# EAGLE design sawbench_digital_reva (EAGLE 6.5.0)
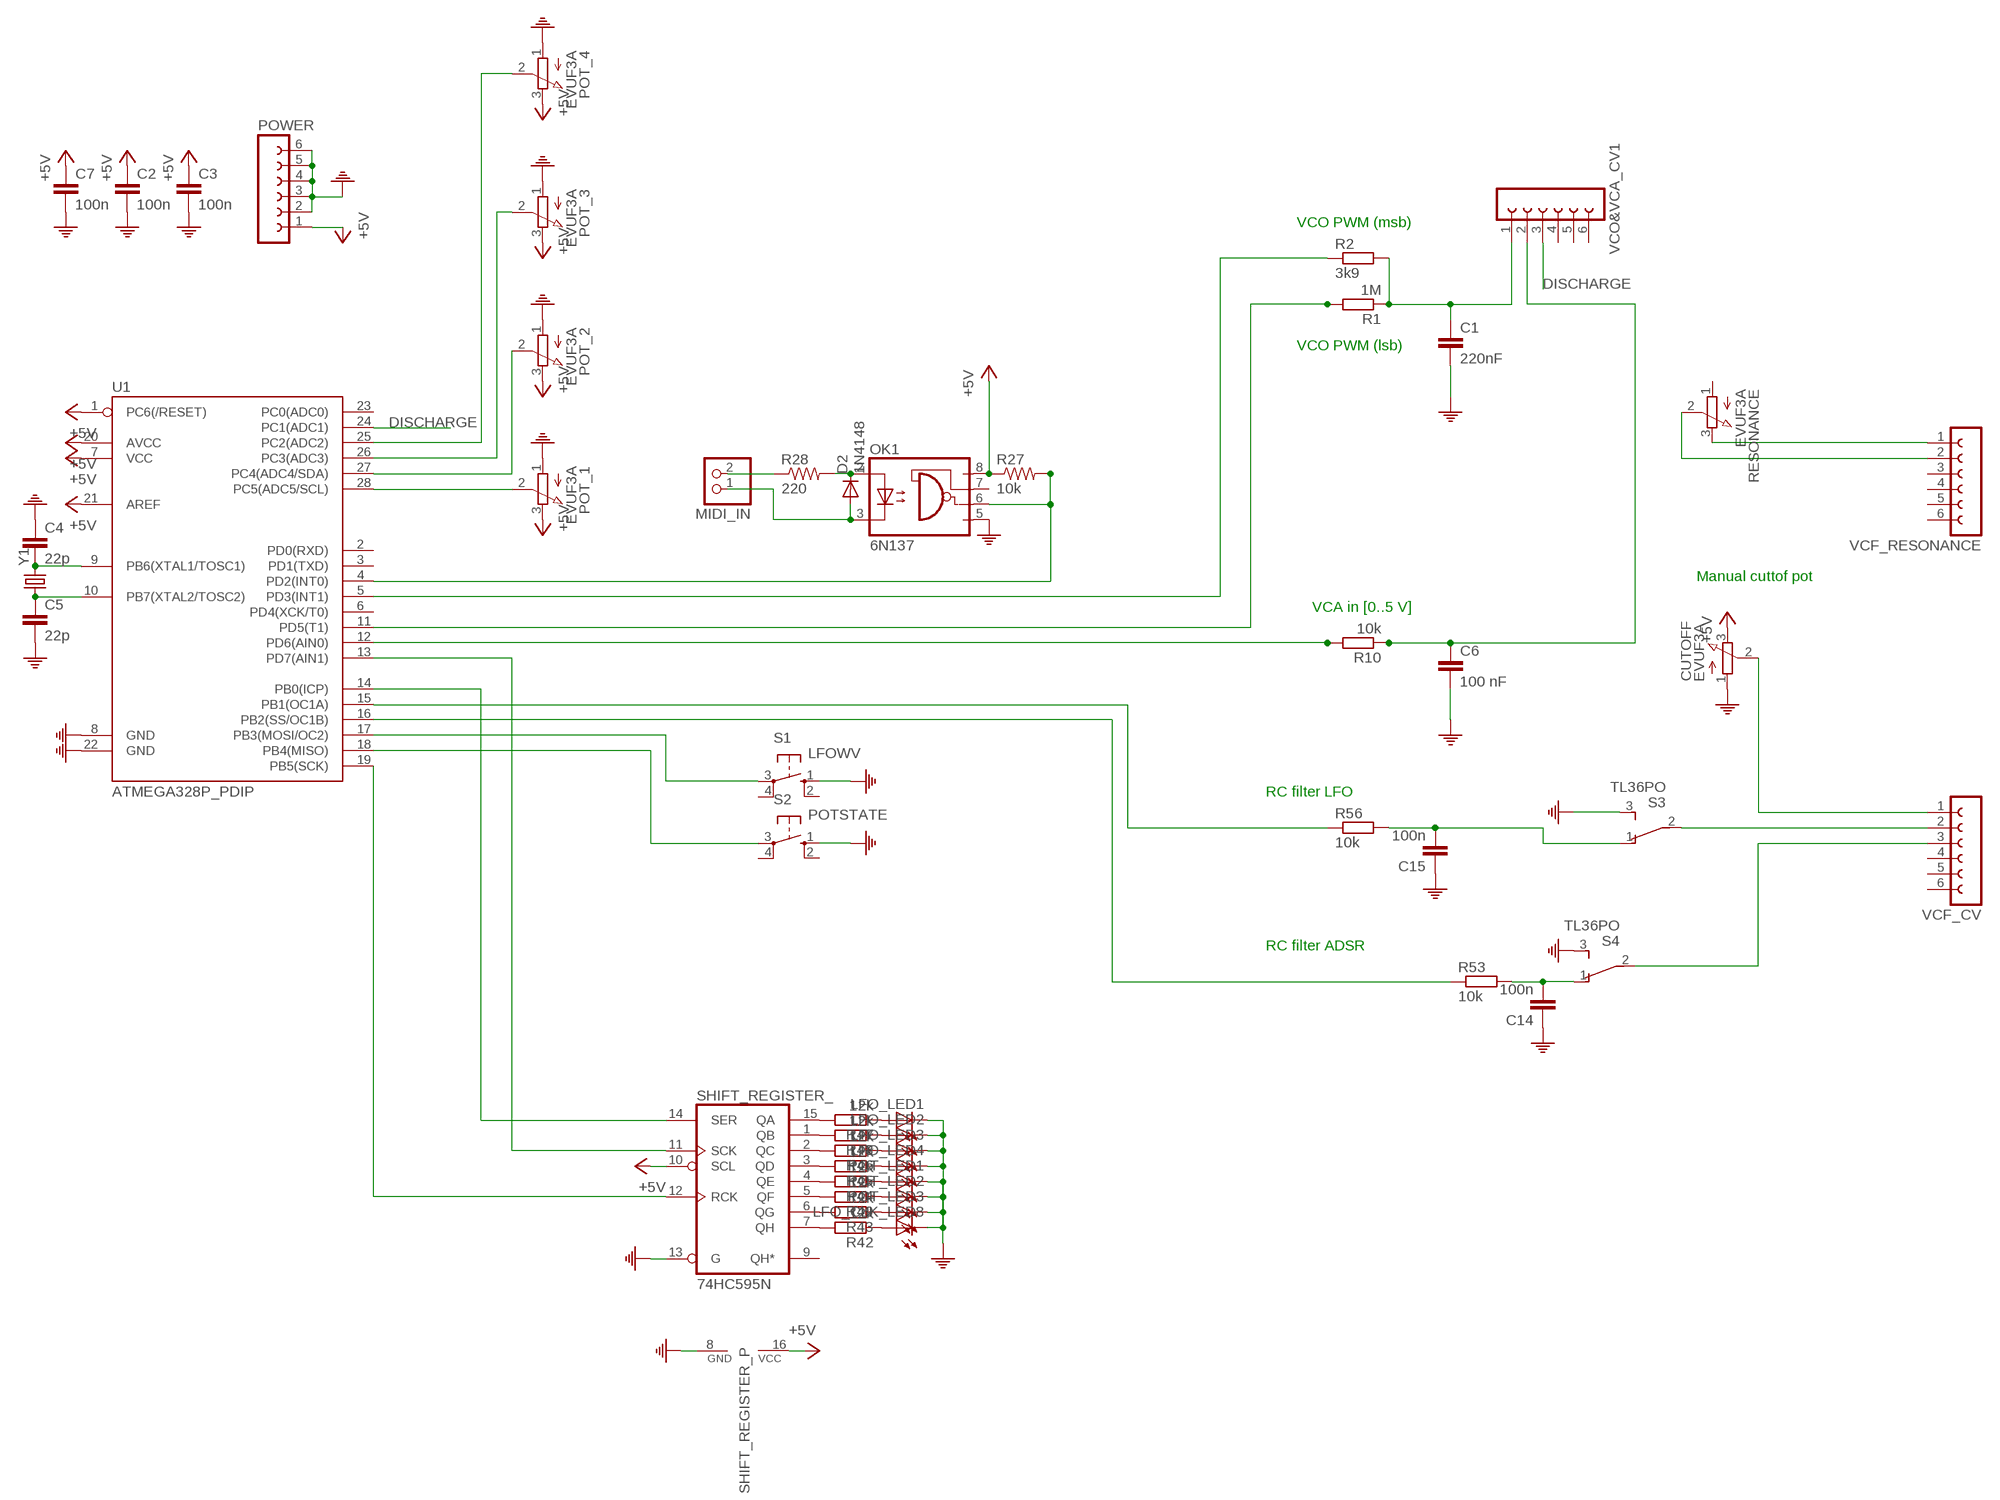
[diagram p0: schematic, sheet 1]

## Parts
C1  220nF  C-EU050-024X044  [C050-024X044]
C2  100n  C-EU025-024X044  [C025-024X044]
C3  100n  C-EU025-024X044  [C025-024X044]
C4  22p  C-EU025-024X044  [C025-024X044]
C5  22p  C-EU025-024X044  [C025-024X044]
C6  100 nF  C-EU025-025X050  [C025-025X050]
C7  100n  C-EU025-024X044  [C025-024X044]
C14  100n  C-EU025-024X044  [C025-024X044]
C15  100n  C-EU025-024X044  [C025-024X044]
CUTOFF  EVUF3A  [EVUF]
D2  1N4148  DIODE-D-5  [D-5]
LFO_CLK_LED8  LED3MM  [LED3MM]
LFO_LED1  LED3MM  [LED3MM]
LFO_LED2  LED3MM  [LED3MM]
LFO_LED3  LED3MM  [LED3MM]
LFO_LED4  LED3MM  [LED3MM]
MIDI_IN  PINHD-1X2  [1X02]
OK1  6N137  [DIL08]
POT_1  EVUF3A  [EVUF]
POT_2  EVUF3A  [EVUF]
POT_3  EVUF3A  [EVUF]
POT_4  EVUF3A  [EVUF]
POT_LED1  LED3MM  [LED3MM]
POT_LED2  LED3MM  [LED3MM]
POT_LED3  LED3MM  [LED3MM]
POWER  FE06-1  [FE06]
R1  1M  R-EU_0204/7  [0204/7]
R2  3k9  R-EU_0204/7  [0204/7]
R10  10k  R-EU_0204/7  [0204/7]
R27  10k  R-US_0204/7  [0204/7]
R28  220  R-US_0204/7  [0204/7]
R42  12k  R-EU_0204/7  [0204/7]
R43  12k  R-EU_0204/7  [0204/7]
R44  12k  R-EU_0204/7  [0204/7]
R45  12k  R-EU_0204/7  [0204/7]
R46  12k  R-EU_0204/7  [0204/7]
R47  12k  R-EU_0204/7  [0204/7]
R48  12k  R-EU_0204/7  [0204/7]
R49  12k  R-EU_0204/7  [0204/7]
R53  10k  R-EU_0204/7  [0204/7]
R56  10k  R-EU_0204/7  [0204/7]
RESONANCE  EVUF3A  [EVUF]
S1  LFOWV  10-XX  [B3F-10XX(TASTYSWITCH)]
S2  POTSTATE  10-XX  [B3F-10XX(TASTYSWITCH)]
S3  TL36PO  [TL3XPO(TASTY_CHIPS_UPDATE)]
S4  TL36PO  [TL3XPO(TASTY_CHIPS_UPDATE)]
SHIFT_REGISTER_  74HC595N  [DIL16]
U1  ATMEGA328P_PDIP  [DIL28-3]
VCF_CV  FE06-1  [FE06]
VCF_RESONANCE  FE06-1  [FE06]
VCO&VCA_CV1  FE06-1  [FE06]
Y1  CRYSTALHC49S  [HC49/S]

## Nets
+5V: C2.1 C3.1 C7.1 CUTOFF.3(E) OK1.8(VCC) POT_1.3(E) POT_2.3(E) POT_3.3(E) POT_4.3(E) POWER.1 R27.1 SHIFT_REGISTER_.10(SCL) SHIFT_REGISTER_.16(VCC) U1.1(PC6(/RESET)) U1.7(VCC) U1.20(AVCC) U1.21(AREF)
DISCHARGE: U1.24(PC1(ADC1)) VCO&VCA_CV1.3
N$1: C1.1 R1.1 R2.2 VCO&VCA_CV1.1
N$2: C6.1 R10.1 VCO&VCA_CV1.2
N$3: R1.2 U1.11(PD5(T1))
N$4: S3.2(P) VCF_CV.2
N$5: S4.2(P) VCF_CV.3
N$6: OK1.6(VO) R27.2 U1.4(PD2(INT0))
N$7: R2.1 U1.5(PD3(INT1))
N$8: POT_1.2(S) U1.28(PC5(ADC5/SCL))
N$9: POT_4.2(S) U1.25(PC2(ADC2))
N$10: POT_2.2(S) U1.27(PC4(ADC4/SDA))
N$11: SHIFT_REGISTER_.11(SCK) U1.13(PD7(AIN1))
N$12: POT_3.2(S) U1.26(PC3(ADC3))
N$13: S1.3(P) U1.17(PB3(MOSI/OC2))
N$14: C4.2 U1.9(PB6(XTAL1/TOSC1)) Y1.2
N$15: C5.1 U1.10(PB7(XTAL2/TOSC2)) Y1.1
N$18: R10.2 U1.12(PD6(AIN0))
N$23: CUTOFF.2(S) VCF_CV.1
N$34: D2.C OK1.2(A) R28.2
N$35: MIDI_IN.2 R28.1
N$44: LFO_LED1.A R47.1
N$46: RESONANCE.3(E) VCF_RESONANCE.1
N$55: C14.2 R53.2 S4.1(O)
N$56: R42.2 SHIFT_REGISTER_.7(QH)
N$57: R43.2 SHIFT_REGISTER_.6(QG)
N$58: R44.2 SHIFT_REGISTER_.4(QE)
N$59: R45.2 SHIFT_REGISTER_.3(QD)
N$60: R46.2 SHIFT_REGISTER_.2(QC)
N$61: R47.2 SHIFT_REGISTER_.15(QA)
N$62: R48.2 SHIFT_REGISTER_.1(QB)
N$63: R49.2 SHIFT_REGISTER_.5(QF)
N$64: LFO_LED2.A R48.1
N$65: LFO_LED3.A R46.1
N$66: LFO_LED4.A R45.1
N$67: POT_LED1.A R44.1
N$68: POT_LED2.A R49.1
N$69: POT_LED3.A R43.1
N$70: LFO_CLK_LED8.A R42.1
N$72: SHIFT_REGISTER_.12(RCK) U1.19(PB5(SCK))
N$74: SHIFT_REGISTER_.14(SER) U1.14(PB0(ICP))
N$80: S2.3(P) U1.18(PB4(MISO))
N$81: C15.2 R56.2 S3.1(O)
N$82: R56.1 U1.15(PB1(OC1A))
N$83: R53.1 U1.16(PB2(SS/OC1B))
N$84: RESONANCE.2(S) VCF_RESONANCE.2
N$87: D2.A MIDI_IN.1 OK1.3(C)
PE: C1.2 C2.2 C3.2 C4.1 C5.2 C6.2 C7.2 C14.1 C15.1 CUTOFF.1(A) LFO_CLK_LED8.K(C) LFO_LED1.K(C) LFO_LED2.K(C) LFO_LED3.K(C) LFO_LED4.K(C) OK1.5(GND) POT_1.1(A) POT_2.1(A) POT_3.1(A) POT_4.1(A) POT_LED1.K(C) POT_LED2.K(C) POT_LED3.K(C) POWER.2 POWER.3 POWER.4 POWER.5 POWER.6 S1.1(S) S2.1(S) S3.3(S) S4.3(S) SHIFT_REGISTER_.8(GND) SHIFT_REGISTER_.13(G) U1.8(GND) U1.22(GND)
Unconnected: OK1.7(VE) RESONANCE.1(A) S1.2(S1) S1.4(P1) S2.2(S1) S2.4(P1) SHIFT_REGISTER_.9(QH*) U1.2(PD0(RXD)) U1.3(PD1(TXD)) U1.6(PD4(XCK/T0)) U1.23(PC0(ADC0)) VCF_CV.4 VCF_CV.5 VCF_CV.6 VCF_RESONANCE.3 VCF_RESONANCE.4 VCF_RESONANCE.5 VCF_RESONANCE.6 VCO&VCA_CV1.4 VCO&VCA_CV1.5 VCO&VCA_CV1.6

## Notes on the sheet
- VCO PWM (msb)
- VCO PWM (lsb)
- Manual cuttof pot
- VCA in [0..5 V]
- RC filter LFO
- RC filter ADSR

## Library data of the parts
C1 C14 C15 = resistor:C-EU: CAPACITOR, European symbol
C2-C7 = rcl:C-EU: CAPACITOR, European symbol
CUTOFF POT_1-POT_4 RESONANCE = pot:EVU: 9 mm Square Rotary Potentiometers Source: Panasonic
D2 = diode:DIODE-: DIODE
LFO_CLK_LED8 LFO_LED1-LFO_LED4 POT_LED1-POT_LED3 = led:LED: LED OSRAM: - CHIPLED LG R971, LG N971, LY N971, LG Q971, LY Q971, LO R971, LY R971 LH N974, LH R974 LS Q976, LO Q976, LY Q976 LO Q996 - Hyper CHIPLED LW Q18S LB Q993, LB Q99A, LB R99A - SideLED LS A670, LO A670, LY A670, LG A670, LP A670 LB A673, LV A673, LT A673, LW A673 LH A674 LY A675 LS A676, LA A676, LO A676, LY A676, LW A676 LS A679, LY A679, LG A679 - Hyper Micro SIDELED® LS Y876, LA Y876, LO Y876, LY Y876 LT Y87S - SmartLED LW L88C, LW L88S LB L89C, LB L89S, LG L890 LS L89K, LO L89K, LY L89K LS L896, LA L896, LO L896, LY L896 - TOPLED LS T670, LO T670, LY T670, LG T670, LP T670 LSG T670, LSP T670, LSY T670, LOP T670, LYG T670 LG T671, LOG T671, LSG T671 LB T673, LV T673, LT T673, LW T673 LH T674 LS T676, LA T676, LO T676, LY T676, LB T676, LH T676, LSB T676, LW T676 LB T67C, LV T67C, LT T67C, LS T67K, LO T67K, LY T67K, LW E67C LS E67B, LA E67B, LO E67B, LY E67B, LB E67C, LV E67C, LT E67C LW T67C LS T679, LY T679, LG T679 LS T770, LO T770, LY T770, LG T770, LP T770 LB T773, LV T773, LT T773, LW T773 LH T774 LS E675, LA E675, LY E675, LS T675 LS T776, LA T776, LO T776, LY T776, LB T776 LHGB T686 LT T68C, LB T68C - Hyper Mini TOPLED® LB M676 - Mini TOPLED Santana® LG M470 LS M47K, LO M47K, LY M47K Source: http://www.osram.convergy.de LUXEON: - LUMILED® LXK2-PW12-R00, LXK2-PW12-S00, LXK2-PW14-U00, LXK2-PW14-V00 LXK2-PM12-R00, LXK2-PM12-S00, LXK2-PM14-U00 LXK2-PE12-Q00, LXK2-PE12-R00, LXK2-PE12-S00, LXK2-PE14-T00, LXK2-PE14-U00 LXK2-PB12-K00, LXK2-PB12-L00, LXK2-PB12-M00, LXK2-PB14-N00, LXK2-PB14-P00, LXK2-PB14-Q00 LXK2-PR12-L00, LXK2-PR12-M00, LXK2-PR14-Q00, LXK2-PR14-R00 LXK2-PD12-Q00, LXK2-PD12-R00, LXK2-PD12-S00 LXK2-PH12-R00, LXK2-PH12-S00 LXK2-PL12-P00, LXK2-PL12-Q00, LXK2-PL12-R00 Source: www.luxeon.com KINGBRIGHT: KA-3528ASYC Source: www.kingbright.com
MIDI_IN = pinhead:PINHD-1X2: PIN HEADER
OK1 = optocoupler:6N137: MOTOROLA OPTO COUPLER
POWER VCF_CV VCF_RESONANCE VCO&VCA_CV1 = con-lsta:FE06-1: FEMALE HEADER; OC_FARNELL: unknown; OC_NEWARK: unknown
R1 R2 R10 R42-R49 R53 R56 = resistor:R-EU_: RESISTOR, European symbol
R27 R28 = rcl:R-US_: RESISTOR, American symbol
S1 S2 = switch-omron:10-XX: OMRON SWITCH; MPN: B3F-1000; OC_FARNELL: 176432; OC_NEWARK: 36M3542
S3 S4 = switch:TL36PO: TINY SWITCH ON - ON Source: http://www2.produktinfo.conrad.com/datenblaetter/700000-724999/705152-da-01-de-Subminiaturschalter_TL_36YO.pdf
SHIFT_REGISTER_ = 74xx-eu:74*595: 8-bit SHIFT REGISTER, output latch
U1 = SparkFun-DigitalIC:ATMEGA328P_PDIP: uC used in the Arduino 32kb flash, 1k EEPROM, 2k SRAM This is the through-hole version of this chip.
Y1 = crystal:CRYSTAL: CRYSTAL; OC_FARNELL: 1667008; OC_NEWARK: unknown

## Net classes
0 default: width 0.203 mm

## Board
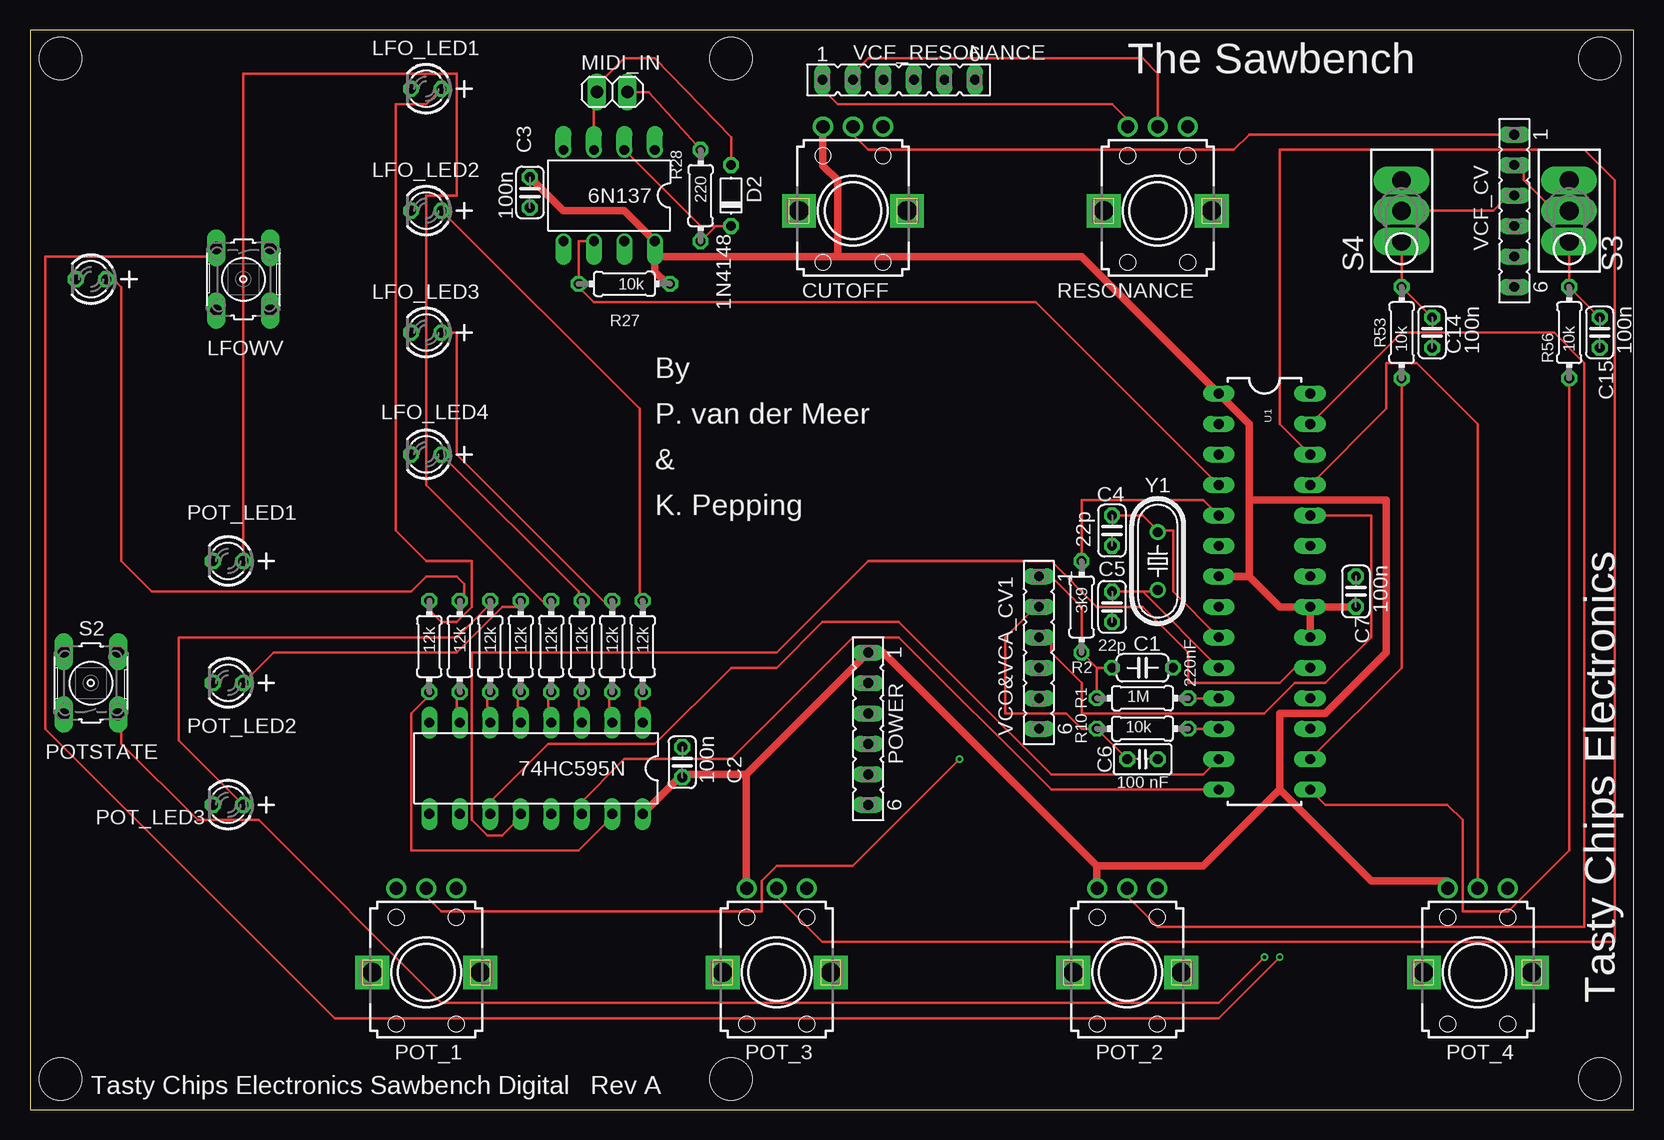
[diagram p1: board, top side]
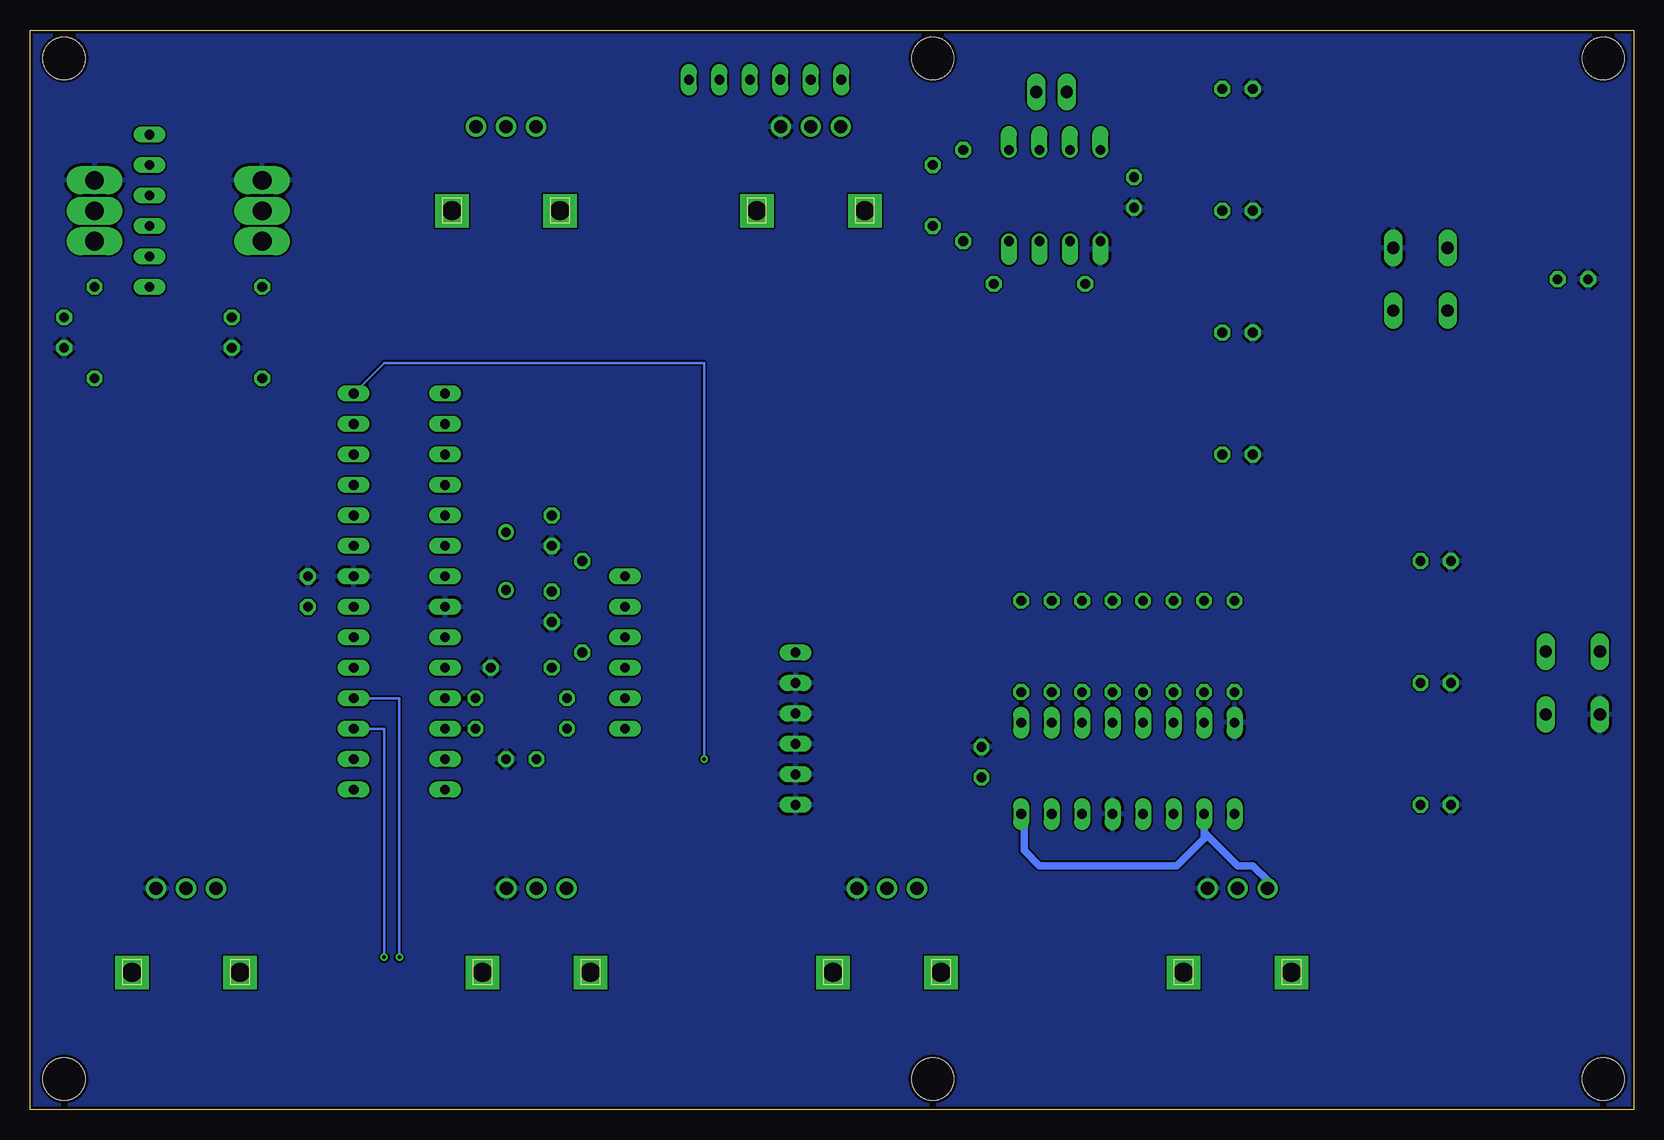
[diagram p2: board, bottom side, seen from below]

Size 133.65 x 90 mm. Coordinates in mm from the lower left corner, seen from the top.
Outline: 0,0 133.65,0 133.65,90 0,90 0,0
Copper layers (1*16): Top 0.035mm / dielectric 1.5mm / Bottom 0.035mm
Design rules "SeeedStudio_2layer_DRU_no_angle_20140221": minimum track width 6mil, minimum drill 12mil, track to track 6mil, track to pad 6mil, pad to pad 6mil, via to via 6mil, smd to smd 0mil, copper to edge 10mil, drill to drill 10mil, minimum pad ring 10mil, minimum via ring 6mil, stop-mask expansion 2mil, vias tented up to drill 100mil, thermal gap 10mil
Holes 3.5 mm at 2.54,87.63 2.54,2.54 130.81,87.63 130.81,2.54 58.42,87.63 58.42,2.54

### Footprints (pad centres in the part's own frame; a part is rotated, then mirrored left to right if it is on the bottom)
C050-024X044 = drill 0.813 octagon: 1 -2.54,0; 2 2.54,0
C025-024X044 = drill 0.813 octagon: 1 -1.27,0; 2 1.27,0
C025-025X050 = drill 0.813 octagon: 1 -1.27,0; 2 1.27,0
EVUF = drill 1.1 pad 1.676: 1 -2.5,-7; 2 0,-7; 3 2.5,-7 | drill 1.6 pad 2.8 square: M1 4.5,0; M2 -4.5,0
D-5 = drill 0.813 octagon: A 2.54,0; C -2.54,0
LED3MM = drill 0.813 octagon: A -1.27,0; K 1.27,0
1X02 = drill 1.016 long: 1 -1.27,0; 2 1.27,0
DIL08 = drill 0.813 offset: 1 -3.81,-3.81; 2 -1.27,-3.81; 3 1.27,-3.81; 4 3.81,-3.81; 5 3.81,3.81; 6 1.27,3.81; 7 -1.27,3.81; 8 -3.81,3.81
FE06 = drill 0.813 long: 1 -6.35,0; 2 -3.81,0; 3 -1.27,0; 4 1.27,0; 5 3.81,0; 6 6.35,0
0204/7 = drill 0.813 octagon: 1 -3.81,0; 2 3.81,0
B3F-10XX(TASTYSWITCH) = drill 1.016 long: 1 -2.616,2.261; 2 2.616,2.261; 3 -2.616,-2.261; 4 2.616,-2.261
TL3XPO(TASTY_CHIPS_UPDATE) = drill 1.554 pad 1.575 long: 1 -2.54,0; 2 0,0; 3 2.54,0
DIL16 = drill 0.813 long: 1 -8.89,-3.81; 2 -6.35,-3.81; 3 -3.81,-3.81; 4 -1.27,-3.81; 5 1.27,-3.81; 6 3.81,-3.81; 7 6.35,-3.81; 8 8.89,-3.81; 9 8.89,3.81; 10 6.35,3.81; 11 3.81,3.81; 12 1.27,3.81; 13 -1.27,3.81; 14 -3.81,3.81; 15 -6.35,3.81; 16 -8.89,3.81
DIL28-3 = drill 0.813 long: 1 -16.51,-3.81; 2 -13.97,-3.81; 3 -11.43,-3.81; 4 -8.89,-3.81; 5 -6.35,-3.81; 6 -3.81,-3.81; 7 -1.27,-3.81; 8 1.27,-3.81; 9 3.81,-3.81; 10 6.35,-3.81; 11 8.89,-3.81; 12 11.43,-3.81; 13 13.97,-3.81; 14 16.51,-3.81; 15 16.51,3.81; 16 13.97,3.81; 17 11.43,3.81; 18 8.89,3.81; 19 6.35,3.81; 20 3.81,3.81; 21 1.27,3.81; 22 -1.27,3.81; 23 -3.81,3.81; 24 -6.35,3.81; 25 -8.89,3.81; 26 -11.43,3.81; 27 -13.97,3.81; 28 -16.51,3.81
HC49/S = drill 0.813: 1 -2.413,0; 2 2.413,0

### Placement (x,y rotation side)
C1  92.71,36.83 0 top
C2  54.36,28.96 90 top
C3  41.66,76.45 270 top
C4  90.17,48.26 90 top
C5  90.17,41.91 270 top
C6  92.71,29.21 0 top
C7  110.49,43.18 90 top
C14  116.84,64.77 90 top
C15  130.81,64.77 90 top
CUTOFF  68.58,74.93 180 top
D2  58.42,76.2 90 top
LFO_CLK_LED8  5.08,69.22 180 top
LFO_LED1  33.02,85.09 180 top
LFO_LED2  33.02,74.93 180 top
LFO_LED3  33.02,64.77 180 top
LFO_LED4  33.02,54.61 180 top
MIDI_IN  48.51,84.84 0 top
OK1  48.26,76.2 180 top
POT_1  33.02,11.43 180 top
POT_2  91.44,11.43 180 top
POT_3  62.23,11.43 180 top
POT_4  120.65,11.43 180 top
POT_LED1  16.51,45.72 180 top
POT_LED2  16.51,35.56 180 top
POT_LED3  16.51,25.4 180 top
POWER  69.85,31.75 270 top
R1  92.71,34.29 0 top
R2  87.63,41.91 270 top
R10  92.71,31.75 0 top
R27  49.53,68.83 180 top
R28  55.88,76.2 270 top
R42  35.81,38.61 270 top
R43  38.35,38.61 270 top
R44  43.43,38.61 270 top
R45  45.97,38.61 270 top
R46  48.51,38.61 270 top
R47  33.27,38.61 270 top
R48  51.05,38.61 270 top
R49  40.89,38.61 270 top
R53  114.3,64.77 90 top
R56  128.27,64.77 90 top
RESONANCE  93.98,74.93 180 top
S1  17.78,69.22 270 top
S2  5.08,35.56 90 top
S3  128.27,74.93 90 top
S4  114.3,74.93 90 top
SHIFT_REGISTER_  42.16,28.45 180 top
U1  102.87,43.18 270 top
VCF_CV  123.7,74.93 270 top
VCF_RESONANCE  72.39,85.85 0 top
VCO&VCA_CV1  84.07,38.1 270 top
Y1  93.98,45.72 90 top

### Tracks (layer width: path | path; a pad name or v marks a point on that pad's centre or on a via)
+5V
  Top 0.203: 50.8,25.4 SHIFT_REGISTER_.16 | 59.69,19.05 POT_3.3 | 88.9,19.05 POT_2.3 | 118.11,19.05 POT_4.3
  Top 0.61: 59.69,27.94 POWER.1 71.12,38.1 88.9,20.32 | 59.69,27.94 54.61,27.94 C2.1 54.1,27.69 SHIFT_REGISTER_.16 | 59.69,27.94 59.69,18.47 POT_3.3 | 88.9,19.05 88.9,20.32 | 88.9,20.32 97.79,20.32 104.14,26.67 | 118.11,19.05 111.76,19.05 104.14,26.67 | 104.14,26.67 104.14,33.02 107.95,33.02 113.03,38.1 113.03,50.8 101.6,50.8 | 101.6,50.8 101.6,57.15 U1.1 87.63,71.12 67.31,71.12 | 101.6,50.8 101.6,44.45 | 101.6,44.45 U1.7 | U1.21 104.14,41.91 101.6,44.45 | U1.21 C7.1 | U1.21 U1.20 | CUTOFF.3 66.08,78.7 67.31,77.47 67.31,71.12 | 67.31,71.12 52.07,71.12 | R27.1 53.09,68.83 52.07,69.85 52.07,71.12 | 52.07,71.12 OK1.8 49.53,74.93 44.45,74.93 C3.1
  Bottom 0.61: SHIFT_REGISTER_.16 50.8,24.38 50.8,21.59 49.53,20.32 38.1,20.32 35.81,22.61 SHIFT_REGISTER_.10 35.81,23.11 33.02,20.32 31.75,20.32 30.48,19.05 30.48,18.47 POT_1.3
DISCHARGE
  Top 0.203: U1.24 111.76,49.53 111.76,39.37 107.95,35.56 105.41,35.56 102.87,33.02 87.63,33.02 87.63,35.56 85.09,38.1 85.09,39.37 VCO&VCA_CV1.3
N$1
  Top 0.203: 88.9,36.83 R2.2 87.63,41.91 85.09,44.45 VCO&VCA_CV1.1 | C1.1 88.9,36.83 | 88.9,36.83 R1.1
N$2
  Top 0.203: C6.1 R10.1 87.63,31.75 86.36,33.02 81.28,33.02 81.28,39.37 83.82,41.91 VCO&VCA_CV1.2
N$3
  Top 0.203: U1.11 R1.2
N$4
  Top 0.203: S3.2 127,74.93 124.46,77.47 124.46,78.74 VCF_CV.2
N$5
  Top 0.203: S4.2 121.92,74.93 123.19,76.2 VCF_CV.3
N$6
  Top 0.203: OK1.6 45.72,72.39 R27.2 45.72,68.58 46.99,67.31 83.82,67.31 U1.4
N$7
  Top 0.203: R2.1 87.63,50.8 97.79,50.8 U1.5
N$8  (via drill 0.3)
  Top 0.203: v77.47,29.21 68.58,20.32 62.23,20.32 60.96,19.05 60.96,16.51 34.29,16.51 33.02,17.78 POT_1.2
  Bottom 0.203: U1.28 104.14,62.23 77.47,62.23 v77.47,29.21
N$9
  Top 0.203: U1.25 113.03,58.42 113.03,62.23 115.57,62.23 120.65,57.15 POT_4.2
N$10
  Top 0.203: U1.27 114.3,64.77 127,64.77 129.54,62.23 129.54,15.24 93.98,15.24 91.44,17.78 POT_2.2
N$11
  Top 0.203: U1.13 97.79,27.94 85.09,27.94 72.39,40.64 66.04,40.64 62.23,36.83 58.42,36.83 52.07,30.48 43.18,30.48 38.1,25.4 SHIFT_REGISTER_.11
N$12
  Top 0.203: U1.26 104.14,57.15 104.14,80.01 129.54,80.01 132.08,77.47 132.08,13.97 66.04,13.97 62.23,17.78 POT_3.2
N$13  (via drill 0.3)
  Top 0.203: v104.14,12.7 99.06,7.62 25.4,7.62 1.27,31.75 1.27,71.12 15.24,71.12 S1.3
  Bottom 0.203: U1.17 104.14,31.75 v104.14,12.7
N$14
  Top 0.203: 93.98,48.26 92.71,49.53 C4.2 | U1.9 95.25,43.18 95.25,48.26 93.98,48.26 | 93.98,48.26 Y1.2
N$15
  Top 0.203: 92.71,43.18 93.98,43.18 Y1.1 | 92.71,43.18 C5.1 | 92.71,43.18 U1.10
N$18
  Top 0.203: U1.12 R10.2
N$23
  Top 0.203: VCF_CV.1 101.6,81.28 100.33,80.01 69.85,80.01 68.58,81.28 CUTOFF.2
N$34
  Top 0.203: 57.15,73.66 R28.2 | D2.C 57.15,73.66 | OK1.2 55.88,73.66 57.15,73.66
N$35
  Top 0.203: R28.1 51.57,84.82 49.53,84.82 MIDI_IN.2
N$44
  Top 0.203: LFO_LED1.A 33.02,83.82 30.48,83.82 30.48,48.26 33.02,45.72 36.83,45.72 36.83,41.91 35.56,40.64 34.29,40.64 33.02,41.91 R47.1
N$46
  Top 0.203: VCF_RESONANCE.1 66.04,85.09 67.31,83.82 90.17,83.82 91.44,82.55 RESONANCE.3
N$55
  Top 0.203: C14.2 R53.2 S4.1
N$56
  Top 0.203: SHIFT_REGISTER_.7 35.56,33.02 35.56,34.29 R42.2
N$57
  Top 0.203: SHIFT_REGISTER_.6 38.1,33.02 38.1,34.29 R43.2
N$58
  Top 0.203: SHIFT_REGISTER_.4 43.18,33.02 43.18,34.29 R44.2
N$59
  Top 0.203: SHIFT_REGISTER_.3 45.72,33.02 45.72,34.29 R45.2
N$60
  Top 0.203: SHIFT_REGISTER_.2 48.26,33.02 48.26,34.29 R46.2
N$61
  Top 0.203: R47.2 33.02,34.29 31.75,33.02 31.75,21.59 45.72,21.59 48.26,24.13 SHIFT_REGISTER_.15
N$62
  Top 0.203: SHIFT_REGISTER_.1 50.8,33.02 50.8,34.29 R48.2
N$63
  Top 0.203: SHIFT_REGISTER_.5 40.64,33.02 40.64,34.29 R49.2
N$64
  Top 0.203: LFO_LED2.A 50.8,58.42 50.8,41.91 R48.1
N$65
  Top 0.203: LFO_LED3.A 35.56,64.77 35.56,54.61 48.26,41.91 R46.1
N$66
  Top 0.203: LFO_LED4.A 45.72,43.18 45.72,41.91 R45.1
N$67
  Top 0.203: POT_LED1.A 17.78,86.36 35.56,86.36 35.56,76.2 33.02,76.2 33.02,52.07 43.18,41.91 R44.1
N$68
  Top 0.203: POT_LED2.A 20.32,38.1 35.56,38.1 39.37,41.91 40.64,41.91 R49.1
N$69
  Top 0.203: POT_LED3.A 12.39,30.79 12.39,39.37 35.56,39.37 38.1,41.91 R43.1
N$70
  Top 0.203: LFO_CLK_LED8.A 6.99,69.22 7.62,68.58 7.62,45.72 10.16,43.18 31.75,43.18 33.02,44.45 35.56,44.45 36.2,43.81 36.2,42.8 R42.1
N$72
  Top 0.203: U1.19 105.41,36.83 104.14,35.56 96.52,35.56 96.52,38.1 92.71,41.91 88.9,41.91 85.09,45.72 69.85,45.72 62.23,38.1 36.83,38.1 36.83,24.13 38.1,22.86 39.37,22.86 40.64,24.13 SHIFT_REGISTER_.12
N$74
  Top 0.203: U1.14 85.09,26.67 72.39,39.37 68.58,39.37 58.42,29.21 49.53,29.21 45.72,25.4 SHIFT_REGISTER_.14
N$80  (via drill 0.3)
  Top 0.203: v102.87,12.7 99.06,8.89 34.29,8.89 19.05,24.13 13.97,24.13 7.62,30.48 7.62,31.75 S2.3
  Bottom 0.203: U1.18 102.87,34.29 v102.87,12.7
N$81
  Top 0.203: C15.2 R56.2 S3.1
N$82
  Top 0.203: U1.15 107.95,25.4 118.11,25.4 119.38,24.13 119.38,16.51 123.19,16.51 128.27,21.59 R56.1
N$83
  Top 0.203: U1.16 114.3,36.83 R53.1
N$84
  Top 0.203: VCF_RESONANCE.2 68.58,86.36 69.85,87.63 92.71,87.63 93.98,86.36 RESONANCE.2
N$87
  Top 0.203: D2.A 58.42,81.05 52.07,87.63 49.53,87.63 46.99,85.09 MIDI_IN.1 46.99,83.82 OK1.3
PE
  pour Bottom: 0,90.17 0,0 133.35,0 133.35,90.17

### Text on the board
tNames: The Sawbench | By | P. van der Meer | & | K. Pepping | Tasty Chips Electronics | Tasty Chips Electronics Sawbench Digital Rev A